# Altium schematic sheet Sensores.SchDoc
size A4
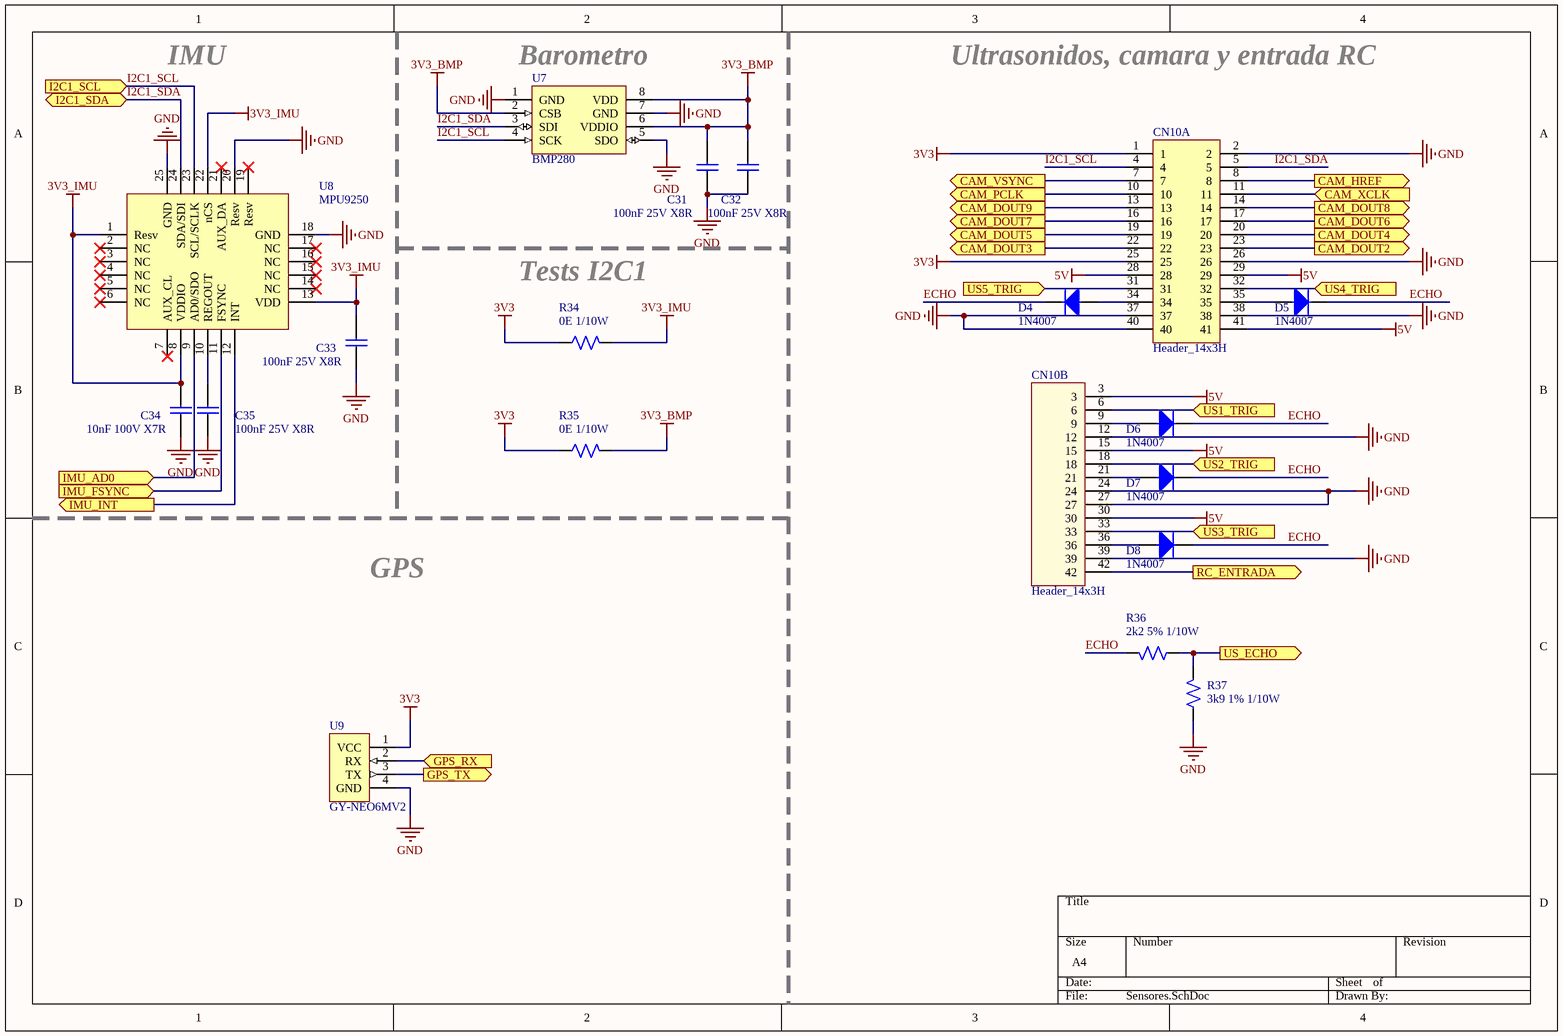
[diagram p0: Sensores.SchDoc]

## Parts
C31  100nF 25V X8R  [C0603]
C32  100nF 25V X8R  [C0603]
C33  100nF 25V X8R  [C0603]
C34  10nF 100V X7R  [C0603]
C35  100nF 25V X8R  [C0603]
CN10  Header_14x3H  [HEADER_14x3H]  (parts A,B of 2)
D4  1N4007  [SMA (DO-214AC)]
D5  1N4007  [SMA (DO-214AC)]
D6  1N4007  [SMA (DO-214AC)]
D7  1N4007  [SMA (DO-214AC)]
D8  1N4007  [SMA (DO-214AC)]
R34  0E 1/10W  [R0805]
R35  0E 1/10W  [R0805]
R36  2k2 5% 1/10W  [R0603]
R37  3k9 1% 1/10W  [R0603]
U7  BMP280  [BMP280]
U8  MPU9250  [MPU9250_HS]
U9  GY-NEO6MV2  [GY-NEO6MV2]

## Ports
CAM_DOUT2 (out), CAM_DOUT3 (out), CAM_DOUT4 (out), CAM_DOUT5 (out), CAM_DOUT6 (out), CAM_DOUT7 (out), CAM_DOUT8 (out), CAM_DOUT9 (out), CAM_HREF (out), CAM_PCLK (out), CAM_VSYNC (out), CAM_XCLK (in), GPS_RX (in), GPS_TX (out), I2C1_SCL (in), I2C1_SDA (bidir), IMU_AD0 (in), IMU_FSYNC (in), IMU_INT (out), RC_ENTRADA (out), US1_TRIG (in), US2_TRIG (in), US3_TRIG (in), US4_TRIG (in), US5_TRIG (in), US_ECHO (out)

## Nets
3V3: CN10.1 CN10.25 R34.1 R35.1 U9.1(VCC)
3V3_BMP: C31.1 C32.1 R35.2 U7.2(CSB) U7.6(VDDIO) U7.8(VDD)
3V3_IMU: C33.1 C34.1 R34.2 U8.1(Resv) U8.8(VDDIO) U8.13(VDD) U8.22(nCS)
5V: CN10.3 CN10.15 CN10.28 CN10.29 CN10.30 CN10.41
GND: C31.2 C32.2 C33.2 C34.2 C35.2 CN10.2 CN10.12 CN10.24 CN10.26 CN10.27 CN10.37 CN10.38 CN10.39 CN10.40 R37.1 U7.1(GND) U7.5(SDO) U7.7(GND) U8.18(GND) U8.20(Resv) U8.25(GND) U9.4(GND)
CAM_DOUT2: CN10.23 ; port CAM_DOUT2
CAM_DOUT3: CN10.22 ; port CAM_DOUT3
CAM_DOUT4: CN10.20 ; port CAM_DOUT4
CAM_DOUT5: CN10.19 ; port CAM_DOUT5
CAM_DOUT6: CN10.17 ; port CAM_DOUT6
CAM_DOUT7: CN10.16 ; port CAM_DOUT7
CAM_DOUT8: CN10.14 ; port CAM_DOUT8
CAM_DOUT9: CN10.13 ; port CAM_DOUT9
CAM_HREF: CN10.8 ; port CAM_HREF
CAM_PCLK: CN10.10 ; port CAM_PCLK
CAM_VSYNC: CN10.7 ; port CAM_VSYNC
CAM_XCLK: CN10.11 ; port CAM_XCLK
ECHO: D4.2 D5.2 D6.2 D7.2 D8.2 R36.2
GPS_RX: U9.2(RX) ; port GPS_RX
GPS_TX: U9.3(TX) ; port GPS_TX
I2C1_SCL: CN10.4 U7.4(SCK) U8.23(SCL/SCLK) ; port I2C1_SCL
I2C1_SDA: CN10.5 U7.3(SDI) U8.24(SDA/SDI) ; port I2C1_SDA
IMU_AD0: U8.9(AD0/SDO) ; port IMU_AD0
IMU_FSYNC: U8.11(FSYNC) ; port IMU_FSYNC
IMU_INT: U8.12(INT) ; port IMU_INT
RC_ENTRADA: CN10.42 ; port RC_ENTRADA
US1_TRIG: CN10.6 ; port US1_TRIG
US2_TRIG: CN10.18 ; port US2_TRIG
US3_TRIG: CN10.33 ; port US3_TRIG
US4_TRIG: CN10.32 ; port US4_TRIG
US5_TRIG: CN10.31 ; port US5_TRIG
US_ECHO: R36.1 R37.2 ; port US_ECHO
NetC35_1: C35.1 U8.10(REGOUT)
NetCN10_9: CN10.9 D6.1
NetCN10_21: CN10.21 D7.1
NetCN10_34: CN10.34 D4.1
NetCN10_35: CN10.35 D5.1
NetCN10_36: CN10.36 D8.1

Not connected (* = marked no-connect by the designer): U8 2(NC)* 3(NC)* 4(NC)* 5(NC)* 6(NC)* 7(AUX_CL)* 14(NC)* 15(NC)* 16(NC)* 17(NC)* 19(Resv)* 21(AUX_DA)*

## Notes on the sheet
- IMU
- (near U7) Barometro
- Ultrasonidos, camara y entrada RC
- Tests I2C1
- GPS

## Library data of the parts
C31-C33 C35 = Capacitor: Capacitor de placas paralelas; Proveedor: Mouser; Cod. Proveedor: 810-C1608X8R1E104K; Encapsulado: C0603; Valor: 100nF; Link: https://ar.mouser.com
C34 = Capacitor: Capacitor de placas paralelas; Proveedor: Mouser; Cod. Proveedor: 81-GCM188R72A103KA7D; Encapsulado: C0603; Valor: 10nF; Link: https://ar.mouser.com
CN10 = Header_14x3H: Header, 14x3-pin
D4-D8 = Diode: Diodo; Cod. Proveedor: DI1202221; Proveedor: Elemon; Encapsulado: SMA; Link: http://www.elemon.net/
R34 R35 = Resistor: Resistencia; Cod. Proveedor: RS3895900; Proveedor: Mouser; Encapsulado: MODIFICAR; Valor: 0E; Link: https://ar.mouser.com
R36 = Resistor: Resistencia; Cod. Proveedor: 71-CRCW06032K20JNEAC; Proveedor: Mouser; Encapsulado: R0603; Valor: 2k2; Link: https://ar.mouser.com
R37 = Resistor: Resistencia; Cod. Proveedor: 71-CRCW06033K90FKEAC; Proveedor: Mouser; Encapsulado: R0603; Valor: 3k9; Link: https://ar.mouser.com
U7 = BMP280: Sensor de presion digital; Proveedor: Digikey; Cod. Proveedor: 828-1064-1-ND; Encapsulado: 8-SMD; Link: https://www.digikey.com/
U8 = MPU9250: IMU 9DOF; Cod. Proveedor: 410-MPU-9250; Proveedor: Mouser; Encapsulado: QFN24; Link: https://ar.mouser.com/
U9 = GY-NEO6MV2: Modulo GPS NEO6 V2